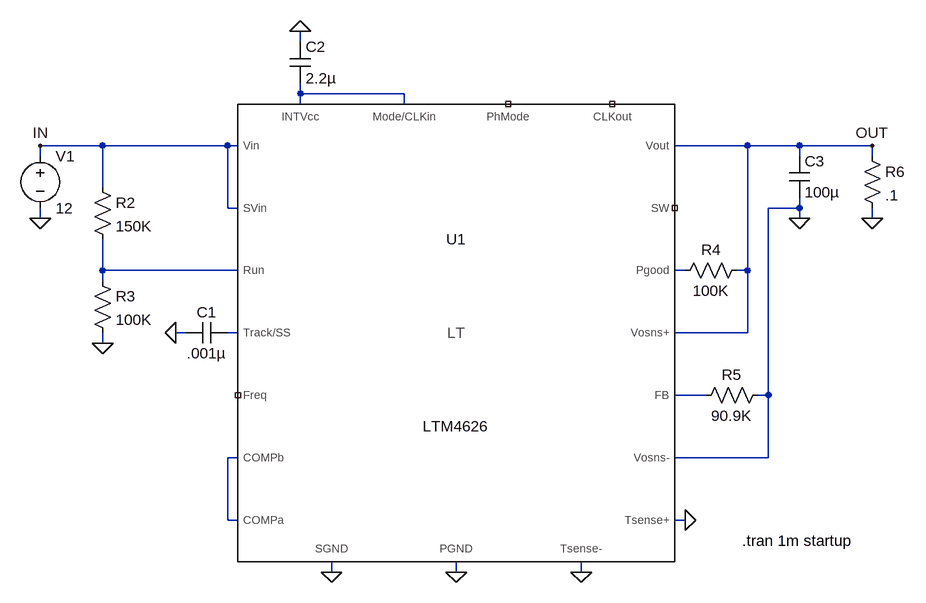
[diagram p0: schematic 4626.asc]
4626.asc, the LTspice schematic file:
Version 4
SHEET 1 932 708
WIRE 0 -256 0 -272
WIRE 0 -176 0 -192
WIRE 160 -176 0 -176
WIRE 0 -160 0 -176
WIRE 160 -160 160 -176
WIRE -304 -96 -400 -96
WIRE -112 -96 -304 -96
WIRE -96 -96 -112 -96
WIRE 688 -96 576 -96
WIRE 768 -96 688 -96
WIRE 880 -96 768 -96
WIRE -400 -80 -400 -96
WIRE 768 -80 768 -96
WIRE 880 -80 880 -96
WIRE -304 -32 -304 -96
WIRE -112 0 -112 -96
WIRE -96 0 -112 0
WIRE 768 0 768 -16
WIRE 768 0 720 0
WIRE -400 16 -400 0
WIRE 768 16 768 0
WIRE 880 16 880 0
WIRE -304 96 -304 48
WIRE -96 96 -304 96
WIRE 592 96 576 96
WIRE 688 96 688 -96
WIRE 688 96 672 96
WIRE -304 112 -304 96
WIRE -176 192 -192 192
WIRE -96 192 -112 192
WIRE 688 192 688 96
WIRE 688 192 576 192
WIRE -304 208 -304 192
WIRE 624 288 576 288
WIRE 720 288 720 0
WIRE 720 288 704 288
WIRE -96 384 -112 384
WIRE 720 384 720 288
WIRE 720 384 576 384
WIRE -112 480 -112 384
WIRE -96 480 -112 480
WIRE 592 480 576 480
WIRE 48 560 48 544
WIRE 240 560 240 544
WIRE 432 560 432 544
FLAG 48 560 0
FLAG 240 560 0
FLAG 432 560 0
FLAG 592 480 0
FLAG -400 16 0
FLAG -304 208 0
FLAG -192 192 0
FLAG 0 -272 0
FLAG 768 16 0
FLAG 880 16 0
FLAG -400 -96 IN
FLAG 880 -96 OUT
SYMBOL PowerProducts\\LTM4626 240 192 R0
SYMATTR InstName U1
SYMBOL res -320 -48 R0
SYMATTR InstName R2
SYMATTR Value 150K
SYMBOL res -320 96 R0
SYMATTR InstName R3
SYMATTR Value 100K
SYMBOL voltage -400 -96 R0
SYMATTR InstName V1
SYMATTR Value 12
SYMBOL cap -112 176 R90
WINDOW 0 0 32 VBottom 2
WINDOW 3 32 32 VTop 2
SYMATTR InstName C1
SYMATTR Value .001µ
SYMBOL cap -16 -256 R0
SYMATTR InstName C2
SYMATTR Value 2.2µ
SYMBOL cap 752 -80 R0
SYMATTR InstName C3
SYMATTR Value 100µ
SYMBOL res 688 80 R90
WINDOW 0 0 56 VBottom 2
WINDOW 3 32 56 VTop 2
SYMATTR InstName R4
SYMATTR Value 100K
SYMBOL res 720 272 R90
WINDOW 0 0 56 VBottom 2
WINDOW 3 32 56 VTop 2
SYMATTR InstName R5
SYMATTR Value 90.9K
SYMBOL res 864 -96 R0
SYMATTR InstName R6
SYMATTR Value .1
TEXT 680 512 Left 2 !.tran 1m startup

The netlist it stands for:
* 4626.asc
XU1 NC_01 NC_02 0 N005 N004 N006 N002 N003 N006 0 NC_03 OUT OUT 0 0 IN IN N001 0 NC_04 N001 LTM4626  ; pins Freq PhMode Vosns- FB Track/SS COMPa Run Pgood COMPb PGND SW Vout Vosns+ Tsense+ Tsense- Vin SVin INTVcc SGND CLKout Mode/CLKin
R2 IN N002 150K
R3 N002 0 100K
V1 IN 0 12
C1 N004 0 .001µ
C2 0 N001 2.2µ
C3 OUT 0 100µ
R4 OUT N003 100K
R5 0 N005 90.9K
R6 OUT 0 .1
.tran 1m startup
.lib LTM4626.sub
.backanno
.end